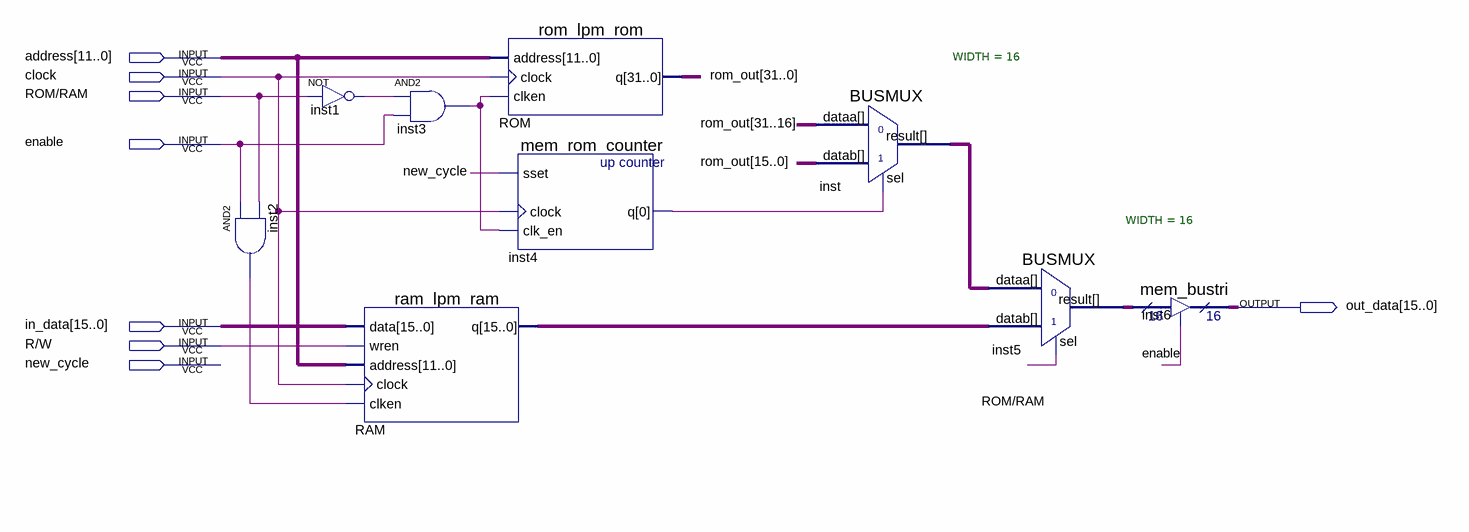
[diagram p0: schematic sheet]
// Quartus schematic Memory.bdf as structural Verilog: 9 symbols, 8 pins
module Memory (
  input  [11:0] address,
  input  clock,
  input  \ROM/RAM ,
  input  enable,
  input  [15:0] in_data,
  input  \R/W ,
  input  new_cycle,
  output [15:0] out_data
);

  wire inst1_out, inst2_out, inst3_out, inst4_q;
  wire [15:0] inst5_result, inst_result, RAM_q;
  wire [31:0] rom_out;

  and inst2 (inst2_out, enable, \ROM/RAM );
  not inst1 (inst1_out, \ROM/RAM );
  ram_lpm_ram RAM (.data(in_data), .wren(\R/W ), .address(address), .clock(clock), .clken(inst2_out), .q(RAM_q));
  and inst3 (inst3_out, inst1_out, enable);
  rom_lpm_rom ROM (.address(address), .clock(clock), .clken(inst3_out), .q(rom_out));
  mem_rom_counter inst4 (.sset(new_cycle), .clock(clock), .clk_en(inst3_out), .q(inst4_q));
  BUSMUX #(.WIDTH(16)) inst (.datab(rom_out[15:0]), .sel(inst4_q), .dataa(rom_out[31:16]), .result(inst_result));
  BUSMUX #(.WIDTH(16)) inst5 (.datab(RAM_q), .sel(\ROM/RAM ), .dataa(inst_result), .result(inst5_result));
  mem_bustri inst6 (.enabledt(enable), .data(inst5_result), .tridata(out_data));
endmodule
